# Altium schematic sheet microcontroller.SchDoc
size Letter; SheetNumber: 7; SheetTotal: 8
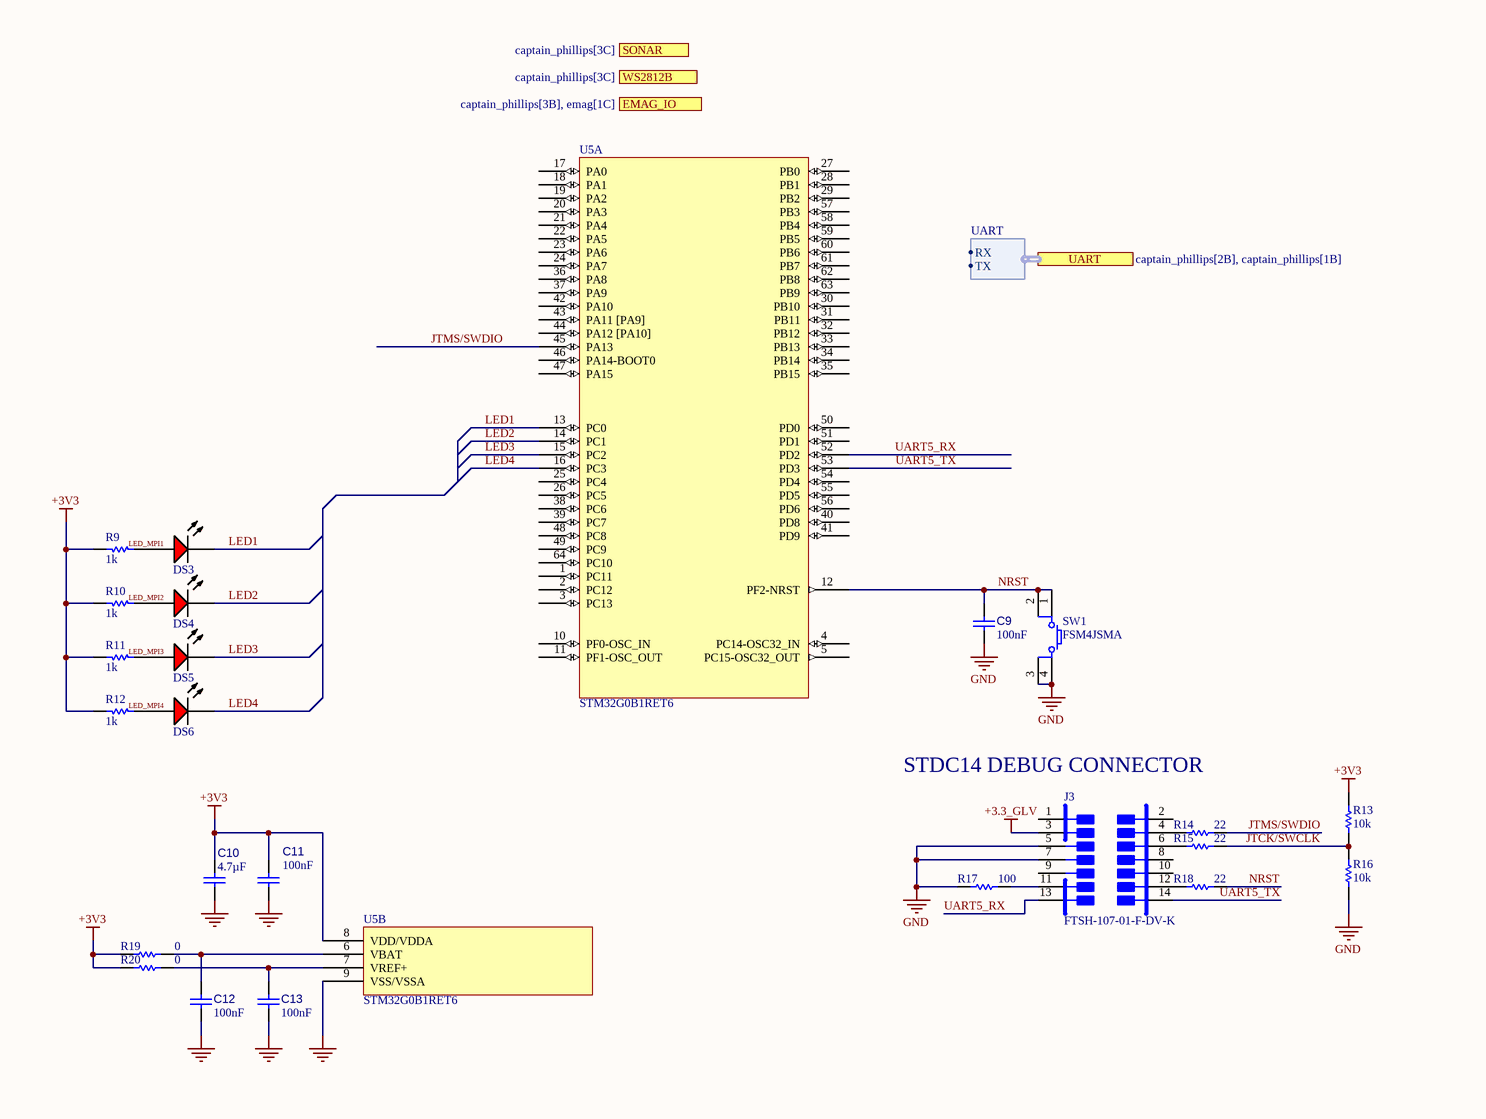
[diagram p0: microcontroller.SchDoc, left]
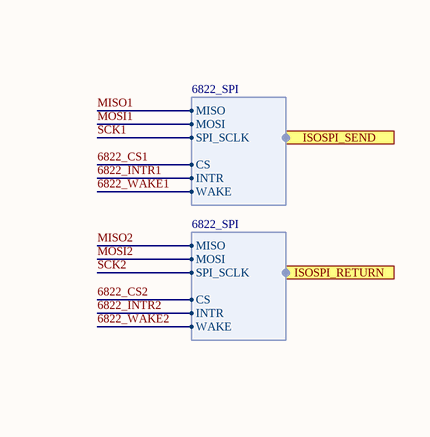
[diagram p1: microcontroller.SchDoc, right]

## Parts
C9  value 100nF  [CAPC1005X05M]  (hidden comment: Capacitor 100nF 10 % 50V 0402)
C10  value 4.7µF  [CAPC1005X05M]  (hidden comment: Capacitor 4.7uF 20 % 10V 0402)
C11  value 100nF  [CAPC1005X05M]  (hidden comment: Capacitor 100nF 10 % 50V 0402)
C12  value 100nF  [CAPC1005X05M]  (hidden comment: Capacitor 100nF 10 % 50V 0402)
C13  value 100nF  [CAPC1005X05M]  (hidden comment: Capacitor 100nF 10 % 50V 0402)
DS3  19-217/R6C-AL1M2VY/3T  [EVRL-0603-2_V]  (value not drawn)
DS4  19-217/R6C-AL1M2VY/3T  [EVRL-0603-2_V]  (value not drawn)
DS5  19-217/R6C-AL1M2VY/3T  [EVRL-0603-2_V]  (value not drawn)
DS6  19-217/R6C-AL1M2VY/3T  [EVRL-0603-2_V]  (value not drawn)
J3  FTSH-107-01-F-DV-K  [FP-FTSH-107-01-F-DV-K-MFG]
R9  value 1k  [RESC1608X55X25ML10T15]  (hidden comment: 1K 1% 0603)
R10  value 1k  [RESC1608X55X25ML10T15]  (hidden comment: 1K 1% 0603)
R11  value 1k  [RESC1608X55X25ML10T15]  (hidden comment: 1K 1% 0603)
R12  value 1k  [RESC1608X55X25ML10T15]  (hidden comment: 1K 1% 0603)
R13  value 10k  [RESC1608X55X25ML10T15]  (hidden comment: 10K 1 0603)
R14  value 22  [RESC1608X55X25ML10T15]  (hidden comment: 22R 1% 0603)
R15  value 22  [RESC1608X55X25ML10T15]  (hidden comment: 22R 1% 0603)
R16  value 10k  [RESC1608X55X25ML10T15]  (hidden comment: 10K 1 0603)
R17  value 100  [RESC1608X55X25ML10T15]  (hidden comment: 100R 1 0603)
R18  value 22  [RESC1608X55X25ML10T15]  (hidden comment: 22R 1% 0603)
R19  value 0  [RESC1608X55X25ML10T15]  (hidden comment: Jumper 0603)
R20  value 0  [RESC1608X55X25ML10T15]  (hidden comment: Jumper 0603)
SW1  FSM4JSMA  [TECO-FSM4JSMA_V]
U5  STM32G0B1RET6  [STM32G0B1RET6-Footprint-1]  (parts A,B of 2)

## Ports
EMAG_IO (see captain_phillips[3B], emag[1C]), ISOSPI_RETURN (harness 6822_SPI), ISOSPI_SEND (harness 6822_SPI), SONAR (see captain_phillips[3C]), UART (harness UART, see captain_phillips[2B], captain_phillips[1B]), WS2812B (see captain_phillips[3C])

## Harnesses
UART: RX, TX
6822_SPI: MISO, MOSI, SPI_SCLK, CS, INTR, WAKE

## Nets
+3.3_GLV: J3.3
+3V3: C10.2 C11.1 R9.2 R10.2 R11.2 R12.2 R13.2 R19.1 R20.1 U5.8(VDD/VDDA)
GND: C9.1 C10.1 C11.2 C12.2 C13.2 J3.5 J3.7 R16.1 R17.1 SW1.3 SW1.4 U5.9(VSS/VSSA)
6822_CS1: port ISOSPI_SEND.CS
6822_CS2: port ISOSPI_RETURN.CS
6822_INTR1: port ISOSPI_SEND.INTR
6822_INTR2: port ISOSPI_RETURN.INTR
6822_WAKE1: port ISOSPI_SEND.WAKE
6822_WAKE2: port ISOSPI_RETURN.WAKE
JTCK/SWCLK: R13.1 R15.2 R16.2
JTMS/SWDIO: R14.2 U5.45(PA13)
LED1: DS3.2(K) U5.13(PC0)
LED2: DS4.2(K) U5.14(PC1)
LED3: DS5.2(K) U5.15(PC2)
LED4: DS6.2(K) U5.16(PC3)
LED_MPI1: DS3.1(A) R9.1
LED_MPI2: DS4.1(A) R10.1
LED_MPI3: DS5.1(A) R11.1
LED_MPI4: DS6.1(A) R12.1
MISO1: port ISOSPI_SEND.MISO
MISO2: port ISOSPI_RETURN.MISO
MOSI1: port ISOSPI_SEND.MOSI
MOSI2: port ISOSPI_RETURN.MOSI
NRST: C9.2 R18.2 SW1.1 SW1.2 U5.12(PF2-NRST)
SCK1: port ISOSPI_SEND.SPI_SCLK
SCK2: port ISOSPI_RETURN.SPI_SCLK
UART5_RX: J3.13 U5.52(PD2)
UART5_TX: J3.14 U5.53(PD3)
NetC12_1: C12.1 R19.2 U5.6(VBAT)
NetC13_1: C13.1 R20.2 U5.7(VREF+)
NetJ3_4: J3.4 R14.1
NetJ3_6: J3.6 R15.1
NetJ3_11: J3.11 R17.2
NetJ3_12: J3.12 R18.1

Not connected (* = marked no-connect by the designer): J3 1 2 8 9 10; U5 1(PC11) 2(PC12) 3(PC13) 4(PC14-OSC32_IN) 5(PC15-OSC32_OUT) 10(PF0-OSC_IN) 11(PF1-OSC_OUT) 17(PA0) 18(PA1) 19(PA2) 20(PA3) 21(PA4) 22(PA5) 23(PA6) 24(PA7) 25(PC4) 26(PC5) 27(PB0) 28(PB1) 29(PB2) 30(PB10) 31(PB11) 32(PB12) 33(PB13) 34(PB14) 35(PB15) 36(PA8) 37(PA9) 38(PC6) 39(PC7) 40(PD8) 41(PD9) 42(PA10) 43(PA11_[PA9]) 44(PA12_[PA10]) 46(PA14-BOOT0) 47(PA15) 48(PC8) 49(PC9) 50(PD0) 51(PD1) 54(PD4) 55(PD5) 56(PD6) 57(PB3) 58(PB4) 59(PB5) 60(PB6) 61(PB7) 62(PB8) 63(PB9) 64(PC10)

## Notes on the sheet
- (near J3) STDC14 DEBUG CONNECTOR

## Library data of the parts
C9 C11-C13 = CMP-001-00135-7: CAP CER 100nF 25V X7R 0402; Tolerance: 10%; Capacitor Type: Ceramic; Case/Package: 0402; Pins: 2; Min Operating Temperature: -55°C; RoHS Compliant: Yes; Mounting Technology: Surface Mount; Max Operating Temperature: 125°C; Voltage Rating: 25V; LCSC Part Number: C307331
C10 = CMP-001-00134-4: CAP CER 4.7uF 10V X7R 0402; Capacitor Type: Ceramic; Tolerance: 20%; Mounting Technology: Surface Mount; Case/Package: 0402; Voltage Rating: 10V; Pins: 2; Min Operating Temperature: -55°C; RoHS Compliant: Yes; Max Operating Temperature: 85°C; LCSC Part Number: C23733
DS3-DS6 = CMP-007-00004-3: Chip LED, Red, 5 V, 25 mA, -40 to 85 degC, 2-Pin SMD (0603), RoHS, Tape and Reel; Manufacturer: Everlight Electronics; Forward Voltage: 2.2V; Lens Style: Clear; Package Reference: 0603; Datasheet Version: Rev. 1, 01/2005; Mounting Technology: SM; RoHS Compliant: False; Datasheet URL: https://datasheet.ciiva.com/4688/el-19-217-r6c-al1m2vy-3tpdf-187026-4688713.pdf; Case/Package: 0603; Colour: Red; Manufacturer URL: http://www.everlight.com/; Package Description: 2-Pin Surface Mount Device, Body 1.6 x 0.8 mm; LCSC Part Number: C2286
J3 = CMP-002-00095-4: Board Connector, 14 Contact(s), 2 Row(s), Male, Straight, 0.05 inch Pitch, Surface Mount Terminal, Locking; RoHS Compliant: Yes; Connector Type: BOARD CONNECTOR; Mounting Technology: Board; LCSC Part Number: C7465995
R9-R12 = CMP-0103-0583-9: 0603 (1608 Metric) 1/10 W 1K 1% Thick Film Chip Resistor; Case-Metric: 1608; Power: 100mW; Case-EIA: 0603; Temp. Coefficent: ±100; Technology: SMT; Tolerance: 1%; Case/Package: 0603; LCSC Part Number: C21190
R13 R16 = CMP-0103-0607-9: 0603 (1608 Metric) 1/10 W 10K 1 Thick Film Chip Resistor; Power: 100mW; Tolerance: 1%; Case-EIA: 0603; Temp. Coefficent: ±100; Case-Metric: 1608; Technology: SMT; Case/Package: 0603; LCSC Part Number: C25804
R14 R15 R18 = CMP-0103-0543-9: 0603 (1608 Metric) 1/10 W 22R 1 Thick Film Chip Resistor; Case-Metric: 1608; Case-EIA: 0603; Temp. Coefficent: ±100; Power: 100mW; Tolerance: 1%; Case/Package: 0603; Technology: SMT; LCSC Part Number: C23345
R17 = CMP-0103-0559-8: 0603 (1608 Metric) 1/10 W 100R 1 Thick Film Chip Resistor; Power: 100mW; Temp. Coefficent: ±100; Tolerance: 1%; Case-Metric: 1608; Case-EIA: 0603; Technology: SMT; Case/Package: 0603; LCSC Part Number: C22775
R19 R20 = CMP-0103-0510-7: Jumper 0603 (1608 Metric); Power: 100mW; Tolerance: 0%; Case-Metric: 1608; Case-EIA: 0603; Temp. Coefficent: None; Case/Package: 0603; Technology: SMT; LCSC Part Number: C21189
SW1 = CMP-00028-00007-2: Switch Tactile OFF (ON) SPST Round Button Gull Wing 0.05A 12VDC 1.57N SMD Loose Piece; Voltage Rating: 24V; Max Current Rating: 50mA; Case/Package: SMD/SMT; Mounting Technology: Surface Mount
U5 = CMP-020-00026-3: RISC Microcontroller, 32-Bit, FLASH, Cortex-M0+ CPU, 64MHz, CMOS, PQFP64; LCSC Part Number: C2829307